# Altium project STLINK.PrjPcb
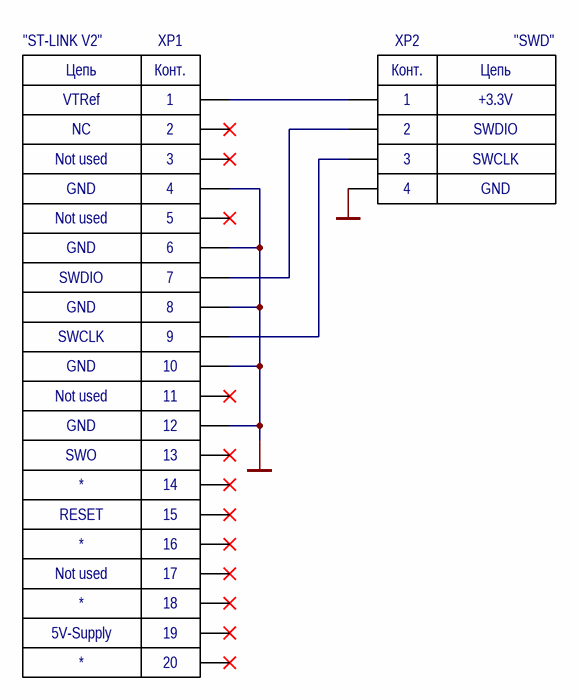
[diagram p0: STLINK-SWD.SchDoc]
2 sheets, 5 parts. Net scope: global (net labels, ports and power ports of the same name join across sheets).
Board files: STLINK.PcbDoc, STLINK_MULT.PcbDoc
Sheets:
  STLINK-SWD.SchDoc
  UART-LA.SchDoc

## Sheet STLINK-SWD.SchDoc
size 209 x 297 mm

### Parts
XP1  Label: "ST-LINK V2"  Circuit7: SWDIO  Circuit8: GND  Circuit9: SWCLK  Circuit11: Not used  Circuit13: SWO  Circuit15: RESET  Circuit19: 5V-Supply  Circuit2: NC  Circuit1: VTRef  [IDC-20MR]  (hidden comment: IDC-20MR)
XP2  Circuit4: GND  Circuit3: SWCLK  Circuit1: +3.3V  Circuit2: SWDIO  Label: "SWD"  [PLS-4R-left]  (hidden comment: PLS-4R)

### Nets
GND: XP1.4 XP1.6 XP1.8 XP1.10 XP1.12 XP2.4
NetXP1_1: XP1.1 XP2.1
NetXP1_7: XP1.7 XP2.2
NetXP1_9: XP1.9 XP2.3

Not connected (* = marked no-connect by the designer): XP1 2* 3* 5* 11* 13* 14* 15* 16* 17* 18* 19* 20*

### Notes on the sheet
- (in symbol IDC-20MR) Цепь; Конт.
- (in symbol PLS-4R) Конт.; Цепь

### Library data of the parts
XP1 = IDC-20MR: Box Header R/A type Pitch 2.54mm; Circuit10: GND; Circuit12: GND; Circuit14: *; Circuit16: *; Circuit17: Not used; Circuit18: *; Circuit20: *; Circuit6: GND; Circuit4: GND; Circuit5: Not used; Circuit3: Not used
XP2 = PLS-4R: Pin Header R/A type Pitch 2.54mm

## Sheet UART-LA.SchDoc
size 209 x 297 mm; SheetNumber: 6; SheetTotal: 6
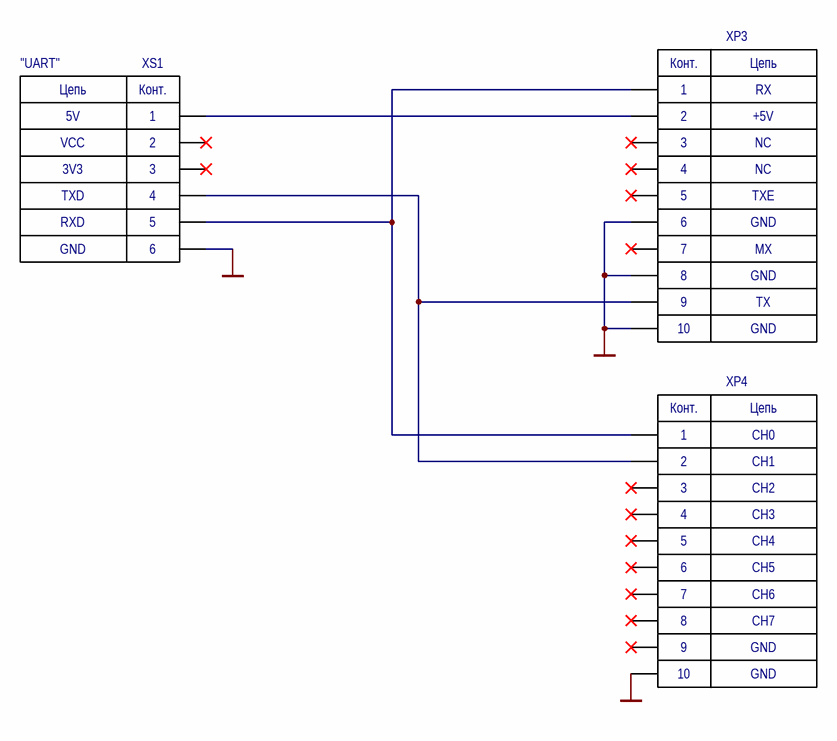
[diagram p1: UART-LA.SchDoc]

### Parts
XP3  Circuit7: MX  Circuit8: GND  Circuit9: TX  Circuit4: NC  Circuit5: TXE  Circuit2: +5V  Circuit1: RX  [IDC-10MS]  (hidden comment: IDC-10MS)
XP4  Circuit7: CH6  Circuit8: CH7  Circuit9: GND  Circuit6: CH5  Circuit4: CH3  Circuit5: CH4  Circuit3: CH2  Circuit2: CH1  Circuit1: CH0  [IDC-10MS]  (hidden comment: IDC-10MS)
XS1  Circuit4: TXD  Circuit5: RXD  Circuit6: GND  Circuit3: 3V3  Circuit1: 5V  Circuit2: VCC  Label: "UART"  [PBS-6R-left]  (hidden comment: PBS-6R)

### Nets
GND: XP3.6 XP3.8 XP3.10 XP4.10 XS1.6
NetXP3_1: XP3.1 XP4.1 XS1.5
NetXP3_2: XP3.2 XS1.1
NetXP3_9: XP3.9 XP4.2 XS1.4

Not connected (* = marked no-connect by the designer): XP3 3* 4* 5* 7*; XP4 3* 4* 5* 6* 7* 8* 9*; XS1 2* 3*

### Notes on the sheet
- (in symbol IDC-10MS) Конт.; Цепь
- (in symbol PBS-6R) Цепь; Конт.

### Library data of the parts
XP3 XP4 = IDC-10MS: Box Header Pitch 2.54mm; Label: "Label"; Circuit10: GND
  XP3: Circuit6: GND; Circuit3: NC
XS1 = PBS-6R: Female Header R/A type Pitch 2.54mm

## Nets that join several sheets
GND: STLINK-SWD (6 pins), UART-LA (5 pins)